# EAGLE design GB SOP32 ROM Adapter mini version (EAGLE 9.4.2)
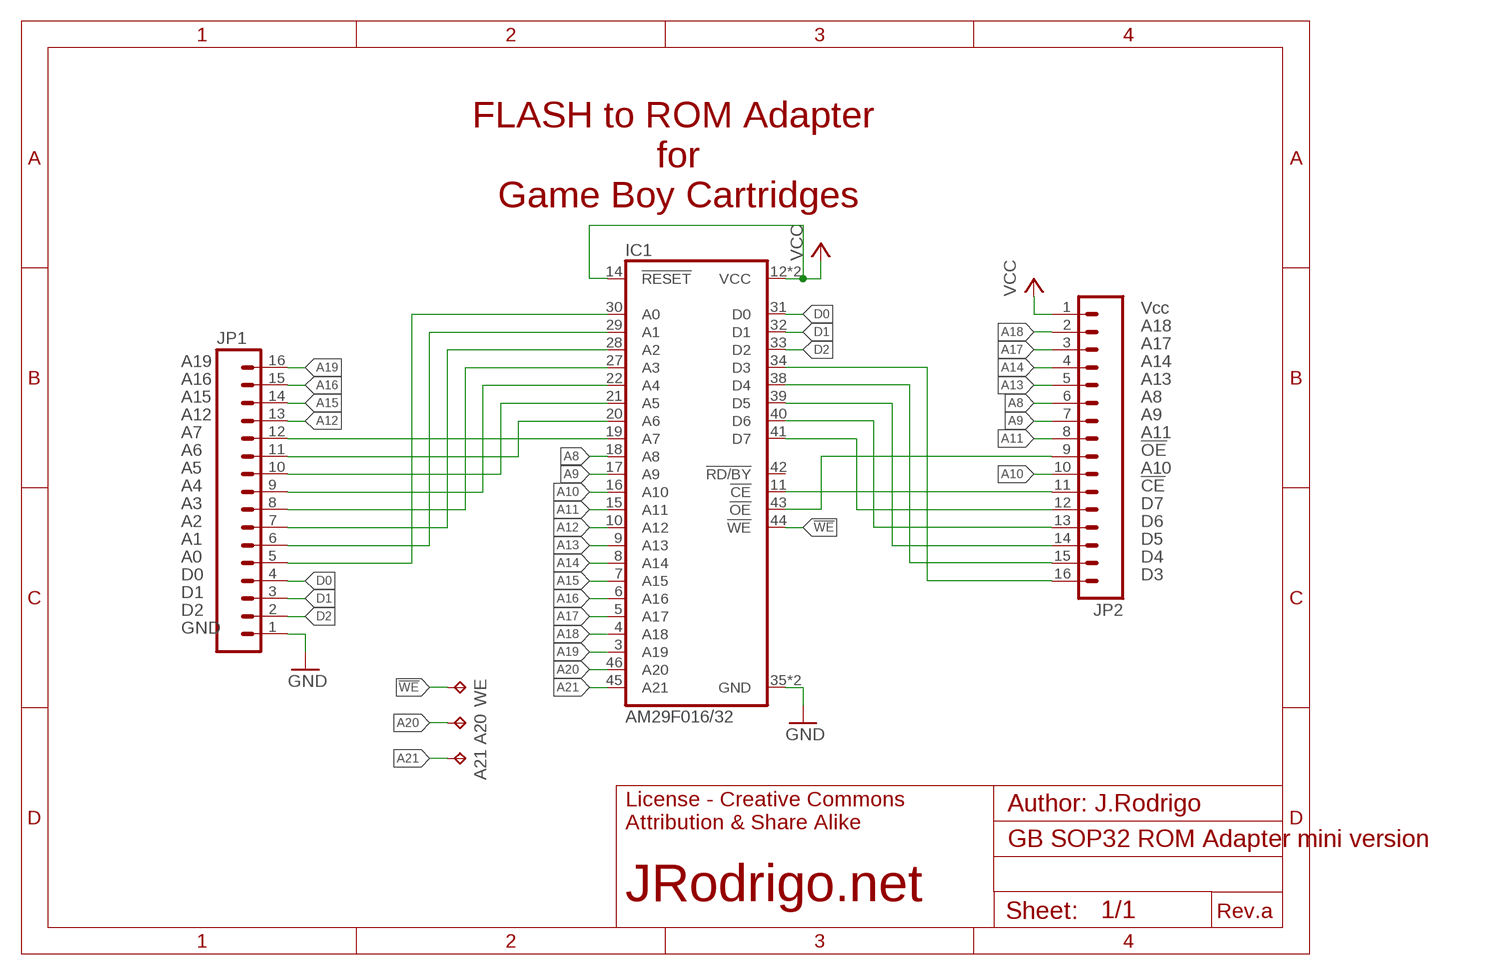
[diagram p0: schematic, sheet 1]

## Parts
A20  TPTP06SQ  [TP06SQ]
A21  TPTP06SQ  [TP06SQ]
IC1  AM29F016/32  AM29FXXXTSOP48_WITHOUT_NC  [TSOP48_WITHOUT_NC]
JP1  CASTELLATIONS_16-PINS*  [CASTELLATIONS_16-PINS]
JP2  CASTELLATIONS_16-PINS*  [CASTELLATIONS_16-PINS]
WE  TPTP06SQ  [TP06SQ]

## Nets
!WE: IC1.44(!WE) WE.TP
A8: IC1.18(A8) JP2.6
A9: IC1.17(A9) JP2.7
A10: IC1.16(A10) JP2.10
A11: IC1.15(A11) JP2.8
A12: IC1.10(A12) JP1.13
A13: IC1.9(A13) JP2.5
A14: IC1.8(A14) JP2.4
A15: IC1.7(A15) JP1.14
A16: IC1.6(A16) JP1.15
A17: IC1.5(A17) JP2.3
A18: IC1.4(A18) JP2.2
A19: IC1.3(A19) JP1.16
A20: A20.TP IC1.46(A20)
A21: A21.TP IC1.45(A21)
D0: IC1.31(D0) JP1.4
D1: IC1.32(D1) JP1.3
D2: IC1.33(D2) JP1.2
GND: IC1.35(GND) IC1.36(GND) JP1.1
N$1: IC1.34(D3) JP2.16
N$2: IC1.38(D4) JP2.15
N$3: IC1.39(D5) JP2.14
N$4: IC1.40(D6) JP2.13
N$5: IC1.41(D7) JP2.12
N$6: IC1.11(!CE) JP2.11
N$7: IC1.43(!OE) JP2.9
N$8: IC1.29(A1) JP1.6
N$9: IC1.28(A2) JP1.7
N$10: IC1.30(A0) JP1.5
N$11: IC1.27(A3) JP1.8
N$12: IC1.22(A4) JP1.9
N$13: IC1.21(A5) JP1.10
N$14: IC1.20(A6) JP1.11
N$15: IC1.19(A7) JP1.12
VCC: IC1.12(VCC) IC1.14(!RESET) IC1.37(VCC) JP2.1
Unconnected: IC1.42(!RD/BY)

## Notes on the sheet
- FLASH to ROM Adapter 
  for
  Game Boy Cartridges
- Vcc
- A18
- A17
- A19 | A14
- A16 | A13
- A15 | A8
- A12 | A9
- A7 | A11
- A6 | !OE
- A5 | A10
- A4 | !CE
- A3 | D7
- A2 | D6
- A1 | D5
- A0 | D4
- D0 | D3
- D1
- D2
- GND
- Author: J.Rodrigo
- License - Creative Commons
  Attribution & Share Alike
- JRodrigo.net
- Rev.a

## Library data of the parts
A20 A21 WE = testpad:TP: Test pad
IC1 = jrodrigo-gameboy:AM29FXXX: FLASH MEMORY
JP1 JP2 = jrodrigo-gameboy:CASTELLATIONS_16-PINS: 1x16 .1" header

## Board
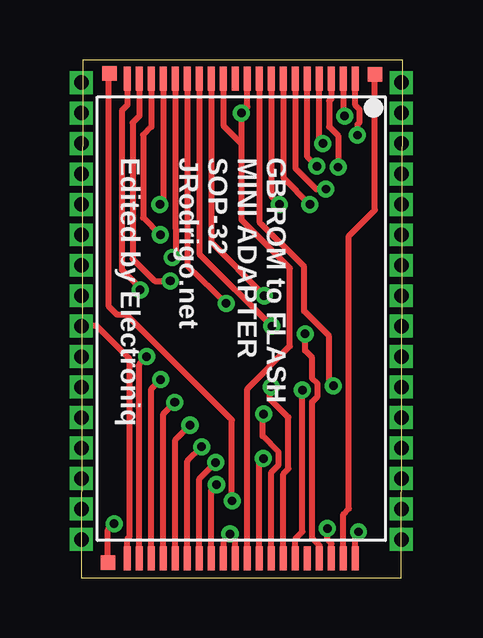
[diagram p1: board, top side]
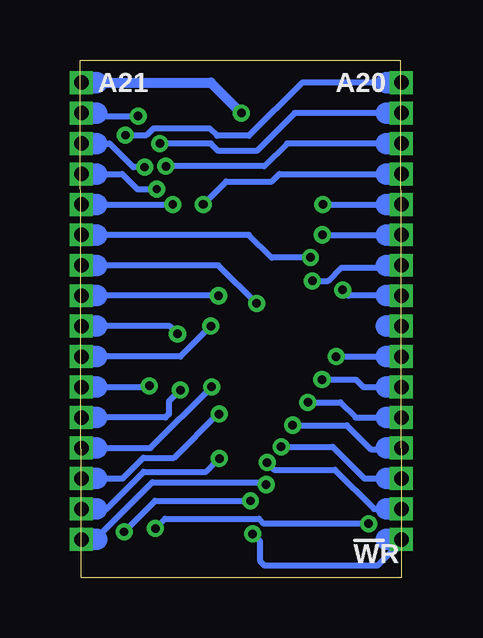
[diagram p2: board, bottom side, seen from below]

Size 13.38 x 21.59 mm. Coordinates in mm from the lower left corner, seen from the top.
Outline: 0,0 13.34,0 13.38,21.59 0.05,21.59 0,0
Copper layers (1*16): Top 0.0356mm / dielectric 1.5011mm / Bottom 0.0356mm
Design rules "oshpark-2layer *": minimum track width 6mil, minimum drill 13mil, track to track 6mil, track to pad 6mil, pad to pad 6mil, via to via 6mil, smd to smd 6mil, copper to edge 15mil, drill to drill 6mil, minimum pad ring 7mil, minimum via ring 7mil, stop-mask expansion 2.5mil, vias tented up to drill 20mil, thermal gap 10mil

### Footprints (pad centres in the part's own frame; a part is rotated, then mirrored left to right if it is on the bottom)
TP06SQ = smd 0.6 x 0.6: TP 0,0
TSOP48_WITHOUT_NC = smd 1 x 0.3: 3 -10,4.75; 4 -10,4.25; 5 -10,3.75; 6 -10,3.25; 7 -10,2.75; 8 -10,2.25; 9 -10,1.75; 10 -10,1.25; 11 -10,0.75; 12 -10,0.25; 13 -10,-0.25; 14 -10,-0.75; 15 -10,-1.25; 16 -10,-1.75; 17 -10,-2.25; 18 -10,-2.75; 19 -10,-3.25; 20 -10,-3.75; 21 -10,-4.25; 22 -10,-4.75; 27 10,-4.75; 28 10,-4.25; 29 10,-3.75; 30 10,-3.25; 31 10,-2.75; 32 10,-2.25; 33 10,-1.75; 34 10,-1.25; 35 10,-0.75; 36 10,-0.25; 37 10,0.25; 38 10,0.75; 39 10,1.25; 40 10,1.75; 41 10,2.25; 42 10,2.75; 43 10,3.25; 44 10,3.75; 45 10,4.25; 46 10,4.75
CASTELLATIONS_16-PINS = drill 0.6 pad 0.889 square: 1 0,0; 2 1.27,0; 3 2.54,0; 4 3.81,0; 5 5.08,0; 6 6.35,0; 7 7.62,0; 8 8.89,0; 9 10.16,0; 10 11.43,0; 11 12.7,0; 12 13.97,0; 13 15.24,0; 14 16.51,0; 15 17.78,0; 16 19.05,0

### Placement (x,y rotation side)
A20  1.17,21.02 0 top
A21  12.23,20.98 0 top
IC1  6.67,10.8 270 top
JP1  0,1.59 90 top
JP2  13.34,20.64 270 top
WE  1.11,0.63 0 top

### Tracks (layer width: path | path; a pad name or v marks a point on that pad's centre or on a via)
!WE  (via drill 0.35 pad 0.7)
  Top 0.254: WE.TP 1.11,1.99 v1.37,2.25 | v10.25,2.05 10.25,1.59 10.42,1.42 IC1.44
  Bottom 0.254: v1.37,2.25 5.73,2.25 5.93,2.46 9.85,2.46 v10.25,2.05
A8  (via drill 0.35 pad 0.7)
  Top 0.254: IC1.18 3.92,14.56 3.92,13.49 v3.79,13.35
  Bottom 0.254: JP2.6 6.35,14.29 5.4,13.34 5.39,13.35 v3.79,13.35
A9  (via drill 0.36)
  Top 0.254: IC1.17 4.42,12.99 v6.03,11.44
  Bottom 0.254: v6.03,11.44 7.62,13.02 JP2.7
A10  (via drill 0.36)
  Top 0.254: IC1.16 4.92,13.5 v7.94,10.48
  Bottom 0.254: v7.94,10.48 9.21,9.21 JP2.10
A11  (via drill 0.36)
  Top 0.254: IC1.15 5.42,13.99 v7.62,11.75
  Bottom 0.254: v7.62,11.75 JP2.8
A12  (via drill 0.36)
  Top 0.254: IC1.10 7.92,15.9 v8.26,15.56
  Bottom 0.254: v8.26,15.56 7.3,16.52 5.4,16.52 5.08,16.83 JP1.13
A13  (via drill 0.35 pad 0.7)
  Top 0.254: IC1.9 8.42,16.67 v9.53,15.56
  Bottom 0.254: JP2.5 v9.53,15.56
A14  (via drill 0.35 pad 0.7)
  Top 0.254: IC1.8 8.92,17.07 9.79,16.2 v10.19,16.2
  Bottom 0.254: JP2.4 11.63,16.83 11,16.2 v10.19,16.2
A15  (via drill 0.36)
  Top 0.254: v9.81,17.15 9.42,17.54 IC1.7
  Bottom 0.254: v9.81,17.15 5.71,17.15 4.76,18.1 JP1.14
A16  (via drill 0.36)
  Top 0.254: v10.06,18.1 9.92,18.25 IC1.6
  Bottom 0.254: v10.06,18.1 7.94,18.1 7.62,17.79 6.03,17.79 4.45,19.37 JP1.15
A17  (via drill 0.35 pad 0.7)
  Top 0.254: v10.7,17.12 10.7,18.42 10.32,18.8 10.32,19.87 10.42,19.97 IC1.5
  Bottom 0.254: v10.7,17.12 11.16,17.12 12.15,18.1 JP2.3
A18  (via drill 0.35 pad 0.7)
  Top 0.254: IC1.4 10.92,19.3 v10.97,19.25
  Bottom 0.254: JP2.2 13.21,19.25 v10.97,19.25
A19  (via drill 0.35 pad 0.7)
  Top 0.254: v11.5,18.45 11.5,18.89 11.6,18.99 11.6,19.51 11.42,19.69 IC1.3
  Bottom 0.254: v11.5,18.45 10.61,18.45 10.32,18.74 8,18.74 7.68,18.42 6.35,18.42 4.13,20.64 JP1.16
A20  (via drill 0.35 pad 0.7)
  Top 0.254: A20.TP 1.15,21 1.15,11.3 1.5,10.95 1.88,10.95 6.27,6.57 6.27,3.22 v6.29,3.2 | IC1.46 11.42,1.77 v11.55,1.91
  Bottom 0.254: v11.55,1.91 10.26,3.2 v6.29,3.2
A21
  Top 0.254: IC1.45 10.92,2.65 11.15,2.88 11.15,14.25 12.23,15.33 A21.TP
D0  (via drill 0.36)
  Top 0.254: IC1.31 3.92,5.74 v4.53,6.36
  Bottom 0.254: v4.53,6.36 2.27,6.36 1.27,5.35 0.05,5.35 JP1.4
D1  (via drill 0.36)
  Top 0.254: IC1.32 4.42,4.86 v5.01,5.45
  Bottom 0.254: v5.01,5.45 2.86,5.45 1.54,4.13 JP1.3
D2  (via drill 0.36)
  Top 0.254: IC1.33 4.92,4.12 v5.6,4.8
  Bottom 0.254: v5.6,4.8 5.3,4.5 2.77,4.5 1.14,2.86 JP1.2
GND  (via drill 0.36)
  Top 0.254: IC1.35 5.92,1.54 v6.2,1.82 6.42,1.6 IC1.36
  Bottom 0.254: v6.2,1.82 5.9,1.52 5.9,0.7 5.7,0.5 1,0.5 0,1.5 JP1.1
N$1  (via drill 0.36)
  Top 0.254: IC1.34 5.42,3.66 v5.63,3.88
  Bottom 0.254: v5.63,3.88 5.73,3.98 10.37,3.98 12.76,1.59 JP2.16
N$2  (via drill 0.36)
  Top 0.254: IC1.38 7.42,4.79 v7.59,4.96
  Bottom 0.254: v7.59,4.96 8.14,4.41 10.73,4.41 12.29,2.86 JP2.15
N$3  (via drill 0.36)
  Top 0.254: IC1.39 7.92,4.4 8.22,4.7 8.22,5.23 7.55,5.9 7.55,6.78 v7.59,6.82
  Bottom 0.254: v7.59,6.82 7.64,6.82 9.46,5 10.75,5 11.62,4.13 JP2.14
N$4  (via drill 0.36)
  Top 0.254: IC1.40 8.42,4.32 8.63,4.53 8.63,6.68 7.86,7.45 7.86,7.9 v7.91,7.95
  Bottom 0.254: JP2.13 10.46,5.4 v7.91,7.95
N$5  (via drill 0.36)
  Top 0.254: IC1.41 8.92,1.62 9.21,1.92 v9.21,7.82
  Bottom 0.254: v9.21,7.82 9.69,7.35 9.69,6.82 9.84,6.67 JP2.12
N$6  (via drill 0.35 pad 0.7)
  Top 0.254: IC1.11 7.42,14.83 9.28,12.97 9.28,11.11 10.32,10.07 10.32,8.18 v10.5,8
  Bottom 0.254: JP2.11 10.56,7.94 v10.5,8
N$7  (via drill 0.36)
  Top 0.254: v9.33,10.16 9.33,9.47 9.62,9.18 9.62,8.31 9.85,8.09 9.85,7.56 9.62,7.33 9.62,1.64 9.92,1.35 IC1.43
  Bottom 0.254: v9.33,10.16 9.64,10.48 JP2.9
N$8  (via drill 0.36)
  Top 0.254: IC1.29 2.92,7.87 v3.31,8.26
  Bottom 0.254: v3.31,8.26 1.91,8.26 1.59,7.94 JP1.6
N$9  (via drill 0.36)
  Top 0.254: IC1.28 2.42,8.91 v2.72,9.21
  Bottom 0.254: v2.72,9.21 JP1.7
N$10  (via drill 0.36)
  Top 0.254: IC1.30 3.42,6.83 v3.89,7.31
  Bottom 0.254: v3.89,7.31 2.54,7.31 1.91,6.67 JP1.5
N$11
  Top 0.254: JP1.8 0.64,10.48 2.01,9.11 2.01,1.71 1.92,1.62 IC1.27
N$12  (via drill 0.35 pad 0.7)
  Top 0.254: IC1.22 1.92,19.7 1.7,19.49 1.7,12.82 2.45,12.07 v2.45,12
  Bottom 0.254: JP1.9 2.2,11.75 v2.45,12
N$13  (via drill 0.36)
  Top 0.254: IC1.21 2.42,19.25 2.14,18.97 2.14,13.29 3.06,12.37 v3.71,12.37
  Bottom 0.254: JP1.10 0.1,12.92 2.5,12.92 3.06,12.37 v3.71,12.37
N$14  (via drill 0.36)
  Top 0.254: IC1.20 2.92,18.8 2.57,18.45 2.57,15.01 v3.29,14.29
  Bottom 0.254: v3.29,14.29 JP1.11
N$15  (via drill 0.36)
  Top 0.254: IC1.19 3.42,15.71 v3.27,15.56
  Bottom 0.254: v3.27,15.56 JP1.12
VCC  (via drill 0.36)
  Top 0.254: IC1.12 6.92,19.62 v6.67,19.37 6.67,18.1 | 6.67,18.1 6.67,14.93 8.69,12.9 8.69,9.65 6.92,7.88 IC1.37 | IC1.14 5.92,18.85 6.67,18.1
  Bottom 0.406: v6.67,19.37 7.94,20.64 JP2.1

### Text on the board
tNames: GB ROM to FLASH / MINI ADAPTER / SOP-32 / JRodrigo.net / / Edited by Electroniq
bNames: A20 | A21 | WR
b_Silk_Screen_Text: GB ROM ADAPTER / JRodrigo.net